# Altium schematic sheet heater_control.SchDoc: Heater Control
size Tabloid; DocumentNumber: LM-003; Revision: 3.0; SheetNumber: 5; SheetTotal: 5
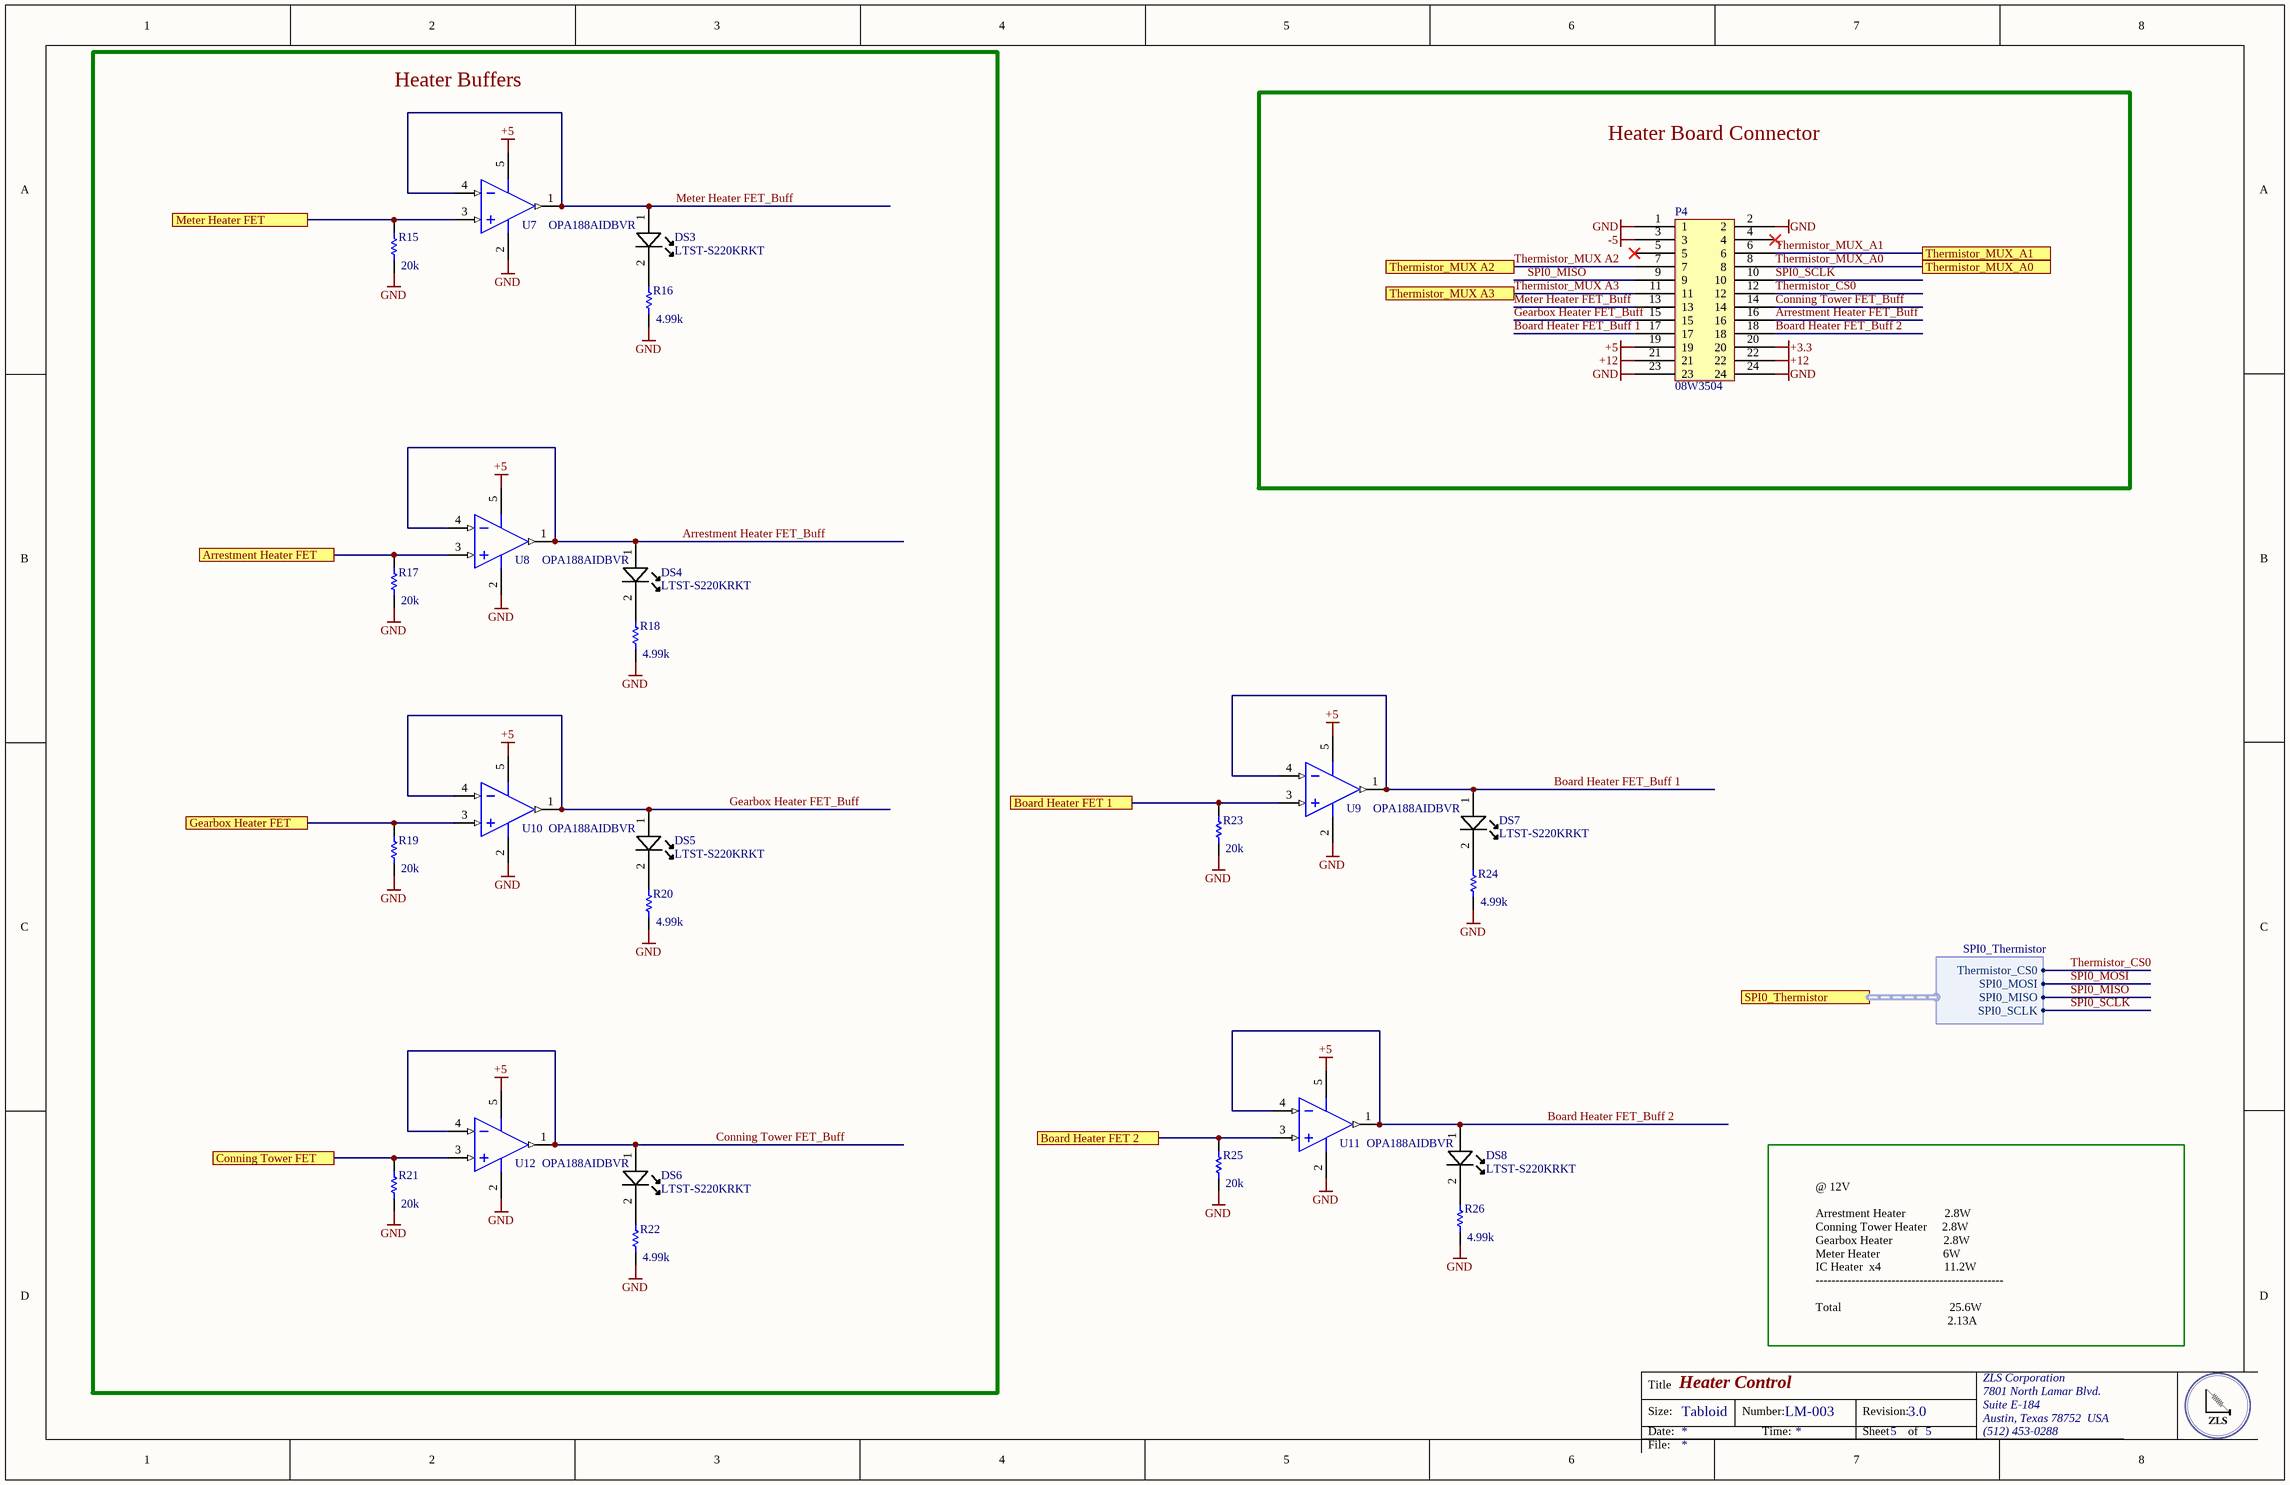
[diagram p0: heater_control.SchDoc]

## Parts
DS3  Manufacturer Part Number: LTST-S220KRKT  [0805C_L]  (hidden comment: Visible Name Value Type    False Description Lite-On LTST-S220KRKT Red LED, 631 nm 2012 (0805) Side View, Rectangle Lens SMD package STRING)
DS4  Manufacturer Part Number: LTST-S220KRKT  [0805C_L]  (hidden comment: Visible Name Value Type    False Description Lite-On LTST-S220KRKT Red LED, 631 nm 2012 (0805) Side View, Rectangle Lens SMD package STRING)
DS5  Manufacturer Part Number: LTST-S220KRKT  [0805C_L]  (hidden comment: Visible Name Value Type    False Description Lite-On LTST-S220KRKT Red LED, 631 nm 2012 (0805) Side View, Rectangle Lens SMD package STRING)
DS6  Manufacturer Part Number: LTST-S220KRKT  [0805C_L]  (hidden comment: Visible Name Value Type    False Description Lite-On LTST-S220KRKT Red LED, 631 nm 2012 (0805) Side View, Rectangle Lens SMD package STRING)
DS7  Manufacturer Part Number: LTST-S220KRKT  [0805C_L]  (hidden comment: Visible Name Value Type    False Description Lite-On LTST-S220KRKT Red LED, 631 nm 2012 (0805) Side View, Rectangle Lens SMD package STRING)
DS8  Manufacturer Part Number: LTST-S220KRKT  [0805C_L]  (hidden comment: Visible Name Value Type    False Description Lite-On LTST-S220KRKT Red LED, 631 nm 2012 (0805) Side View, Rectangle Lens SMD package STRING)
P4  Supplier Part Number 1: 08W3504  [IPL1-112-01-F-S-K]  (hidden comment: IPL1-112-01-F-S-K)
R15  20k  [RESC0402(1005)_M]
R16  4.99k  [RESC0402(1005)_M]
R17  20k  [RESC0402(1005)_M]
R18  4.99k  [RESC0402(1005)_M]
R19  20k  [RESC0402(1005)_M]
R20  4.99k  [RESC0402(1005)_M]
R21  20k  [RESC0402(1005)_M]
R22  4.99k  [RESC0402(1005)_M]
R23  20k  [RESC0402(1005)_M]
R24  4.99k  [RESC0402(1005)_M]
R25  20k  [RESC0402(1005)_M]
R26  4.99k  [RESC0402(1005)_M]
U7  OPA188AIDBVR  [DBV0005A_M]
U8  OPA188AIDBVR  [DBV0005A_M]
U9  OPA188AIDBVR  [DBV0005A_M]
U10  OPA188AIDBVR  [DBV0005A_M]
U11  OPA188AIDBVR  [DBV0005A_M]
U12  OPA188AIDBVR  [DBV0005A_M]

## Blocks framed on the sheet
Heater Buffers: DS3-DS6 R15-R22 U7 U8 U10 U12
Heater Board Connector: P4

## Ports
Arrestment Heater FET, Board Heater FET 1, Board Heater FET 2, Conning Tower FET, Gearbox Heater FET, Meter Heater FET, SPI0_Thermistor (harness SPI0_Thermistor), Thermistor_MUX A2, Thermistor_MUX A3, Thermistor_MUX_A0, Thermistor_MUX_A1

## Harnesses
SPI0_Thermistor: Thermistor_CS0, SPI0_MOSI, SPI0_MISO, SPI0_SCLK

## Nets
+3.3: P4.20
+5: P4.19 U7.5(V+) U8.5(V+) U9.5(V+) U10.5(V+) U11.5(V+) U12.5(V+)
+12: P4.21 P4.22
-5: P4.3
GND: P4.1 P4.2 P4.23 P4.24 R15.2 R16.2 R17.2 R18.2 R19.2 R20.2 R21.2 R22.2 R23.2 R24.2 R25.2 R26.2 U7.2(V-) U8.2(V-) U9.2(V-) U10.2(V-) U11.2(V-) U12.2(V-)
Arrestment Heater FET: R17.1 U8.3(IN+) ; port Arrestment Heater FET
Arrestment Heater FET_Buff: DS4.1(A) P4.16 U8.1(OUT) U8.4(IN-)
Board Heater FET 1: R23.1 U9.3(IN+) ; port Board Heater FET 1
Board Heater FET 2: R25.1 U11.3(IN+) ; port Board Heater FET 2
Board Heater FET_Buff 1: DS7.1(A) P4.17 U9.1(OUT) U9.4(IN-)
Board Heater FET_Buff 2: DS8.1(A) P4.18 U11.1(OUT) U11.4(IN-)
Conning Tower FET: R21.1 U12.3(IN+) ; port Conning Tower FET
Conning Tower FET_Buff: DS6.1(A) P4.14 U12.1(OUT) U12.4(IN-)
Gearbox Heater FET: R19.1 U10.3(IN+) ; port Gearbox Heater FET
Gearbox Heater FET_Buff: DS5.1(A) P4.15 U10.1(OUT) U10.4(IN-)
Meter Heater FET: R15.1 U7.3(IN+) ; port Meter Heater FET
Meter Heater FET_Buff: DS3.1(A) P4.13 U7.1(OUT) U7.4(IN-)
SPI0_MISO: P4.9 ; port SPI0_Thermistor.SPI0_MISO
SPI0_MOSI: port SPI0_Thermistor.SPI0_MOSI
SPI0_SCLK: P4.10 ; port SPI0_Thermistor.SPI0_SCLK
Thermistor_CS0: P4.12 ; port SPI0_Thermistor.Thermistor_CS0
Thermistor_MUX A2: P4.7 ; port Thermistor_MUX A2
Thermistor_MUX A3: P4.11 ; port Thermistor_MUX A3
Thermistor_MUX_A0: P4.8 ; port Thermistor_MUX_A0
Thermistor_MUX_A1: P4.6 ; port Thermistor_MUX_A1
NetDS3_2: DS3.2(K) R16.1
NetDS4_2: DS4.2(K) R18.1
NetDS5_2: DS5.2(K) R20.1
NetDS6_2: DS6.2(K) R22.1
NetDS7_2: DS7.2(K) R24.1
NetDS8_2: DS8.2(K) R26.1

Not connected (* = marked no-connect by the designer): P4 4* 5*

## Notes on the sheet
- @ 12V
  Arrestment Heater             2.8W
  Conning Tower Heater     2.8W
  Gearbox Heater                 2.8W
  Meter Heater                     6W
  IC Heater  x4                     11.2W
  -----------------------------------------------
  Total                                    25.6W
  2.13A
- Title
- Size:
- Date:
- Tabloid
- Number:
- Time:
- Revision:
- Sheet
- of
- ZLS Corporation
- 7801 North Lamar Blvd.
- Suite E-184
- Austin, Texas 78752  USA
- (512) 453-0288
- File:

## Library data of the parts
DS3-DS8 = LED A/K: Manufacturer: Vishay / Lite-On; Lens Colour: Colorless; Lens Style: Diffused,Colorless; Viewing Angle: 130°; Luminous Intensity: 54mcd; Forward Current: 20mA; Forward Voltage: 2V; Power Rating: 75mW; Dominant Wavelength: 631nm; Lens Transparency: Clear; Number of Elements: 1; Wavelength: 639nm; Supplier 1: Digi-Key; Supplier Part Number 1: 160-1469-1-ND; Stock 1: 108191; Pricing 1: 1=0.31, 10=0.225, 25=0.1656, 100=0.1183, 250=0.0804, 500=0.071, 1000=0.0556 (USD); Mount: Surface Mount; Case/Package: 0805; Number of Pins: 2; Colour: Red; Case Code (Metric): 2012; Case Code (Imperial): 0805; Min Operating Temperature: -55°C; Max Operating Temperature: 85°C; Packaging: Tape and Reel; Package Quantity: 4000; Illumination Colour: Red; Test Current: 20mA; Power Dissipation: 75mW; Number of LEDs: 1; Length: 2.1mm; Height: 0.6mm; Width: 1mm; Depth: 0.6mm; Radiation Hardening: No; Lead Free: Lead Free; ComponentLink1URL: https://datasheet.ciiva.com/2110/s-110-ltst-s220krkt-2110132.pdf; ComponentLink1Description: https://datasheet.ciiva.com/2110/s-110-ltst-s220krkt-2110132.pdf; ComponentLink2URL: https://datasheet.ciiva.com/2110/s-110-ltst-s220krkt-2110133.pdf; ComponentLink2Description: https://datasheet.ciiva.com/2110/s-110-ltst-s220krkt-2110133.pdf; ComponentLink3URL: https://datasheet.ciiva.com/2110/s-110-ltst-s220krkt-2110134.pdf; ComponentLink3Description: https://datasheet.ciiva.com/2110/s-110-ltst-s220krkt-2110134.pdf; ComponentLink4URL: https://datasheet.ciiva.com/12403/lite-on-ltst-s220krkt-187389-12403798.pdf; ComponentLink4Description: https://datasheet.ciiva.com/12403/lite-on-ltst-s220krkt-187389-12403798.pdf; ComponentLink5URL: https://datasheet.ciiva.com/16345/lite-onltst-s220krkt-16345511.pdf; ComponentLink5Description: https://datasheet.ciiva.com/16345/lite-onltst-s220krkt-16345511.pdf; ComponentLink6URL: https://datasheet.ciiva.com/15118/getdatasheetpartid-225752-15118120.pdf; ComponentLink6Description: https://datasheet.ciiva.com/15118/getdatasheetpartid-225752-15118120.pdf; ComponentLink7URL: https://datasheet.ciiva.com/14633/0900766b80dc0b76-14633737.pdf; ComponentLink7Description: https://datasheet.ciiva.com/14633/0900766b80dc0b76-14633737.pdf; ComponentLink8URL: https://datasheet.ciiva.com/11775/0900766b80dc0b76-11775439.pdf; ComponentLink8Description: https://datasheet.ciiva.com/11775/0900766b80dc0b76-11775439.pdf
P4 = IPL1-112-01-F-S-K: IPL1-112-01-F-D-K; Supplier 1: Newark
R15-R26 = CMP-1011-00651-1
U7-U12 = CMP-0809-00005-2: Precision, Low Noise, Rail-to-Rail Output, Zero-Drift Operational Amplifier, 4 to 36 V, -40 to 125 degC, 5-pin SOT23 (DBV5), Green (RoHS & no Sb/Br); Manufacturer: Texas Instruments; Total Supply Voltage(Min)(+5V is 5, +/-5V is 10): 4; Offset Drift(Typ)(uV/C): 0.03; Rating: Catalog; SubFamily: Zero Drift Precision Amplifier; GBW(Typ)(MHz): 2; Slew Rate(Typ)(V/us): 0.8; Number of Channels: 1; CMRR(Min)(dB): 120; Iq per channel(Max)(mA): 0.51; Total Supply Voltage(Max)(+5V is 5, +/-5V is 10): 36; PartNumber: OPA188AIDBVR; ComponentLink2Description: Datasheet; ComponentLink2URL: http://www.ti.com/lit/ds/symlink/opa188.pdf; ComponentLink1Description: Manufacturer URL; Mounting Technology: Surface Mount; Eco-Plan: Green (RoHS & no Sb/Br); ComponentLink1URL: http://www.ti.com/; PackageVersion: 4073253-4/K, 03/2006; DatasheetVersion: SBOS642A; ComponentLink3Description: Package Specification; PackageReference: DBV0005A; ComponentLink3URL: http://www.ti.com/litv/pdf/mpds018i; PackageDescription: 5-Pin Plastic Small Outline, Body 1.6 x 2.9 mm, Pitch 0.95 mm; Code_JEDEC: MO-178